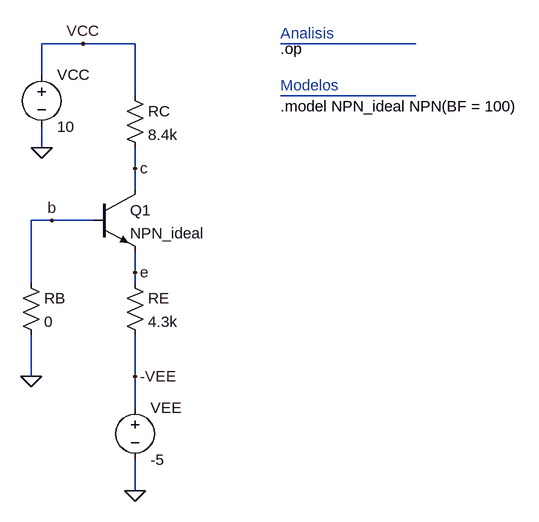
[diagram p0: schematic example2.asc]
example2.asc, the LTspice schematic file:
Version 4
SHEET 1 916 680
WIRE -368 -832 -432 -832
WIRE -288 -832 -368 -832
WIRE 144 -832 -64 -832
WIRE -432 -784 -432 -832
WIRE -288 -752 -288 -832
WIRE 144 -752 -64 -752
WIRE -432 -672 -432 -704
WIRE -288 -640 -288 -672
WIRE -288 -608 -288 -640
WIRE -416 -560 -448 -560
WIRE -352 -560 -416 -560
WIRE -288 -480 -288 -512
WIRE -448 -464 -448 -560
WIRE -288 -464 -288 -480
WIRE -448 -320 -448 -384
WIRE -288 -320 -288 -384
WIRE -288 -272 -288 -320
WIRE -288 -144 -288 -192
FLAG -432 -672 0
FLAG -448 -320 0
FLAG -416 -560 b
FLAG -288 -640 c
FLAG -288 -480 e
FLAG -368 -832 VCC
FLAG -288 -144 0
FLAG -288 -320 -VEE
SYMBOL npn -352 -608 R0
SYMATTR InstName Q1
SYMATTR Value NPN_ideal
SYMBOL res -464 -480 R0
SYMATTR InstName RB
SYMATTR Value 0
SYMBOL res -304 -768 R0
SYMATTR InstName RC
SYMATTR Value 8.4k
SYMBOL voltage -432 -800 R0
WINDOW 123 0 0 Left 0
WINDOW 39 0 0 Left 0
SYMATTR InstName VCC
SYMATTR Value 10
SYMBOL res -304 -480 R0
SYMATTR InstName RE
SYMATTR Value 4.3k
SYMBOL voltage -288 -288 R0
WINDOW 123 0 0 Left 0
WINDOW 39 0 0 Left 0
SYMATTR InstName VEE
SYMATTR Value -5
TEXT -64 -848 Left 2 ;Analisis
TEXT -64 -824 Left 2 !.op
TEXT -64 -736 Left 2 !.model NPN_ideal NPN(BF = 100)
TEXT -64 -768 Left 2 ;Modelos

The netlist it stands for:
* example2.asc
Q1 c b e 0 NPN_ideal
RB b 0 0
RC VCC c 8.4k
VCC VCC 0 10
RE e -VEE 4.3k
VEE -VEE 0 -5
.model NPN NPN
.model PNP PNP
.lib standard.bjt
* Analisis
.op
.model NPN_ideal NPN(BF = 100)
* Modelos
.backanno
.end